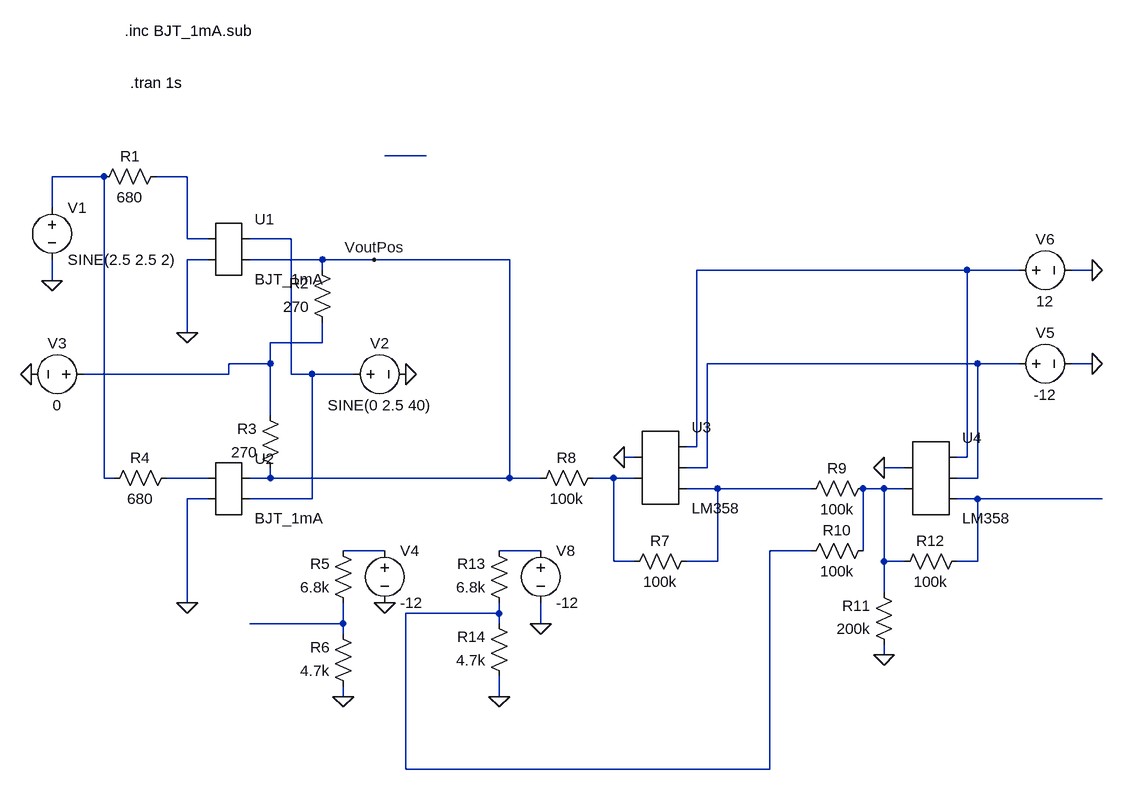
[diagram p0: schematic multi-vca.asc]
multi-vca.asc, the LTspice schematic file:
Version 4
SHEET 1 1732 1044
WIRE 688 96 624 96
WIRE 192 128 112 128
WIRE 320 128 272 128
WIRE 112 176 112 128
WIRE 320 224 320 128
WIRE 352 224 320 224
WIRE 480 224 416 224
WIRE 352 256 320 256
WIRE 528 256 416 256
WIRE 608 256 528 256
WIRE 816 256 608 256
WIRE 528 272 528 256
WIRE 1520 272 1104 272
WIRE 1600 272 1520 272
WIRE 1712 272 1680 272
WIRE 112 288 112 256
WIRE 320 368 320 256
WIRE 528 384 528 352
WIRE 528 384 448 384
WIRE 448 416 448 384
WIRE 448 416 384 416
WIRE 1536 416 1120 416
WIRE 1600 416 1536 416
WIRE 1712 416 1680 416
WIRE 384 432 384 416
WIRE 384 432 160 432
WIRE 480 432 480 224
WIRE 512 432 480 432
WIRE 576 432 512 432
WIRE 448 496 448 416
WIRE 1104 544 1104 272
WIRE 1104 544 1088 544
WIRE 1008 560 992 560
WIRE 1520 560 1520 272
WIRE 1520 560 1504 560
WIRE 1120 576 1120 416
WIRE 1120 576 1088 576
WIRE 1424 576 1392 576
WIRE 192 592 192 128
WIRE 208 592 192 592
WIRE 352 592 288 592
WIRE 448 592 448 576
WIRE 448 592 416 592
WIRE 816 592 816 256
WIRE 816 592 448 592
WIRE 864 592 816 592
WIRE 976 592 944 592
WIRE 1008 592 976 592
WIRE 1536 592 1536 416
WIRE 1536 592 1504 592
WIRE 1136 608 1088 608
WIRE 1280 608 1136 608
WIRE 1392 608 1360 608
WIRE 1424 608 1392 608
WIRE 352 624 320 624
WIRE 512 624 512 432
WIRE 512 624 416 624
WIRE 1536 624 1504 624
WIRE 1728 624 1536 624
WIRE 624 704 560 704
WIRE 864 704 800 704
WIRE 1280 704 1216 704
WIRE 1360 704 1360 608
WIRE 976 720 976 592
WIRE 1008 720 976 720
WIRE 1136 720 1136 608
WIRE 1136 720 1088 720
WIRE 1392 720 1392 608
WIRE 1424 720 1392 720
WIRE 1536 720 1536 624
WIRE 1536 720 1504 720
WIRE 1392 768 1392 720
WIRE 320 784 320 624
WIRE 800 800 800 784
WIRE 800 800 656 800
WIRE 560 816 560 784
WIRE 560 816 416 816
WIRE 800 816 800 800
WIRE 864 816 864 784
WIRE 560 832 560 816
WIRE 1392 864 1392 848
WIRE 560 928 560 912
WIRE 800 928 800 896
WIRE 656 1040 656 800
WIRE 1216 1040 1216 704
WIRE 1216 1040 656 1040
FLAG 112 288 0
FLAG 320 368 0
FLAG 656 432 0
FLAG 320 784 0
FLAG 608 256 VoutPos
FLAG 80 432 0
FLAG 624 784 0
FLAG 560 928 0
FLAG 1712 272 0
FLAG 1712 416 0
FLAG 992 560 0
FLAG 1392 864 0
FLAG 1392 576 0
FLAG 864 816 0
FLAG 800 928 0
SYMBOL voltage 112 160 R0
SYMATTR InstName V1
SYMATTR Value SINE(2.5 2.5 2)
SYMBOL res 288 112 R90
WINDOW 0 0 56 VBottom 2
WINDOW 3 32 56 VTop 2
SYMATTR InstName R1
SYMATTR Value 680
SYMBOL voltage 560 432 R270
WINDOW 0 32 56 VTop 2
WINDOW 3 -32 56 VBottom 2
SYMATTR InstName V2
SYMATTR Value SINE(0 2.5 40)
SYMBOL AutoGenerated/BJT_1mA 384 240 R0
SYMATTR InstName U1
SYMBOL res 544 368 R180
WINDOW 0 36 76 Left 2
WINDOW 3 36 40 Left 2
SYMATTR InstName R2
SYMATTR Value 270
SYMBOL AutoGenerated/BJT_1mA 384 608 R0
SYMATTR InstName U2
SYMBOL res 304 576 R90
WINDOW 0 0 56 VBottom 2
WINDOW 3 32 56 VTop 2
SYMATTR InstName R4
SYMATTR Value 680
SYMBOL res 464 592 R180
WINDOW 0 36 76 Left 2
WINDOW 3 36 40 Left 2
SYMATTR InstName R3
SYMATTR Value 270
SYMBOL voltage 176 432 R90
WINDOW 0 -32 56 VBottom 2
WINDOW 3 32 56 VTop 2
SYMATTR InstName V3
SYMATTR Value 0
SYMBOL voltage 624 688 R0
SYMATTR InstName V4
SYMATTR Value -12
SYMBOL res 576 800 R180
WINDOW 0 36 76 Left 2
WINDOW 3 36 40 Left 2
SYMATTR InstName R5
SYMATTR Value 6.8k
SYMBOL res 576 928 R180
WINDOW 0 36 76 Left 2
WINDOW 3 36 40 Left 2
SYMATTR InstName R6
SYMATTR Value 4.7k
SYMBOL AutoGenerated/LM358 1040 576 R0
SYMATTR InstName U3
SYMBOL voltage 1584 416 R270
WINDOW 0 32 56 VTop 2
WINDOW 3 -32 56 VBottom 2
SYMATTR InstName V5
SYMATTR Value -12
SYMBOL voltage 1584 272 R270
WINDOW 0 32 56 VTop 2
WINDOW 3 -32 56 VBottom 2
SYMATTR InstName V6
SYMATTR Value 12
SYMBOL res 1104 704 R90
WINDOW 0 0 56 VBottom 2
WINDOW 3 32 56 VTop 2
SYMATTR InstName R7
SYMATTR Value 100k
SYMBOL res 960 576 R90
WINDOW 0 0 56 VBottom 2
WINDOW 3 32 56 VTop 2
SYMATTR InstName R8
SYMATTR Value 100k
SYMBOL AutoGenerated/LM358 1456 592 R0
SYMATTR InstName U4
SYMBOL res 1376 592 R90
WINDOW 0 0 56 VBottom 2
WINDOW 3 32 56 VTop 2
SYMATTR InstName R9
SYMATTR Value 100k
SYMBOL res 1376 688 R90
WINDOW 0 0 56 VBottom 2
WINDOW 3 32 56 VTop 2
SYMATTR InstName R10
SYMATTR Value 100k
SYMBOL res 1408 864 R180
WINDOW 0 36 76 Left 2
WINDOW 3 36 40 Left 2
SYMATTR InstName R11
SYMATTR Value 200k
SYMBOL res 1520 704 R90
WINDOW 0 0 56 VBottom 2
WINDOW 3 32 56 VTop 2
SYMATTR InstName R12
SYMATTR Value 100k
SYMBOL voltage 864 688 R0
SYMATTR InstName V8
SYMATTR Value -12
SYMBOL res 816 800 R180
WINDOW 0 36 76 Left 2
WINDOW 3 36 40 Left 2
SYMATTR InstName R13
SYMATTR Value 6.8k
SYMBOL res 816 912 R180
WINDOW 0 36 76 Left 2
WINDOW 3 36 40 Left 2
SYMATTR InstName R14
SYMATTR Value 4.7k
TEXT 232 -16 Left 2 !.tran 1s
TEXT 224 -96 Left 2 !.inc BJT_1mA.sub

The netlist it stands for:
* multi-vca.asc
V1 N002 0 SINE(2.5 2.5 2)
R1 N003 N002 680
V2 N004 0 SINE(0 2.5 40)
* U1: BJT_1mA (symbol AutoGenerated/BJT_1mA not available, pins judged from their places): pin1=N003 pin2=0 pin3=N004 pin4=VoutPos
R2 N006 VoutPos 270
* U2: BJT_1mA (symbol AutoGenerated/BJT_1mA not available, pins judged from their places): pin1=N008 pin2=0 pin3=VoutPos pin4=N004
R4 N008 N002 680
R3 VoutPos N006 270
V3 N006 0 0
V4 N013 0 -12
R5 N016 N013 6.8k
R6 0 N016 4.7k
* U3: LM358 (symbol AutoGenerated/LM358 not available, pins judged from their places): pin1=0 pin2=N009 pin3=N005 pin4=N007 pin5=N010
V5 N007 0 -12
V6 N005 0 12
R7 N010 N009 100k
R8 N009 VoutPos 100k
* U4: LM358 (symbol AutoGenerated/LM358 not available, pins judged from their places): pin1=0 pin2=N011 pin3=N005 pin4=N007 pin5=N012
R9 N011 N010 100k
R10 N011 N015 100k
R11 0 N011 200k
R12 N012 N011 100k
V8 N014 0 -12
R13 N015 N014 6.8k
R14 0 N015 4.7k
.tran 1s
.inc BJT_1mA.sub
.backanno
.end